# Altium schematic sheet SLT3-PAY-1Q2T_P0.SchDoc: SVPXFMC Carrier 3U
size A4; CheckedBy: \; Author: G.Kasprowicz; CompanyName: ISE; DrawnBy: T.Przywozki; Organization: WUT ISE; Address1: Warsaw University of Technology; Address2: Nowowiejska 15/19 00-665 Warsaw; Revision: 1.0.; SheetNumber: 14; SheetTotal: 20; Project: SVPXFMC Carrier 3U; ModifiedBy: -; CheckedDate: -; Title2: SpaceVPX P0, SLT3-PAY-1Q2T; DivGrp: ISE; Designer: G. Kasprowicz
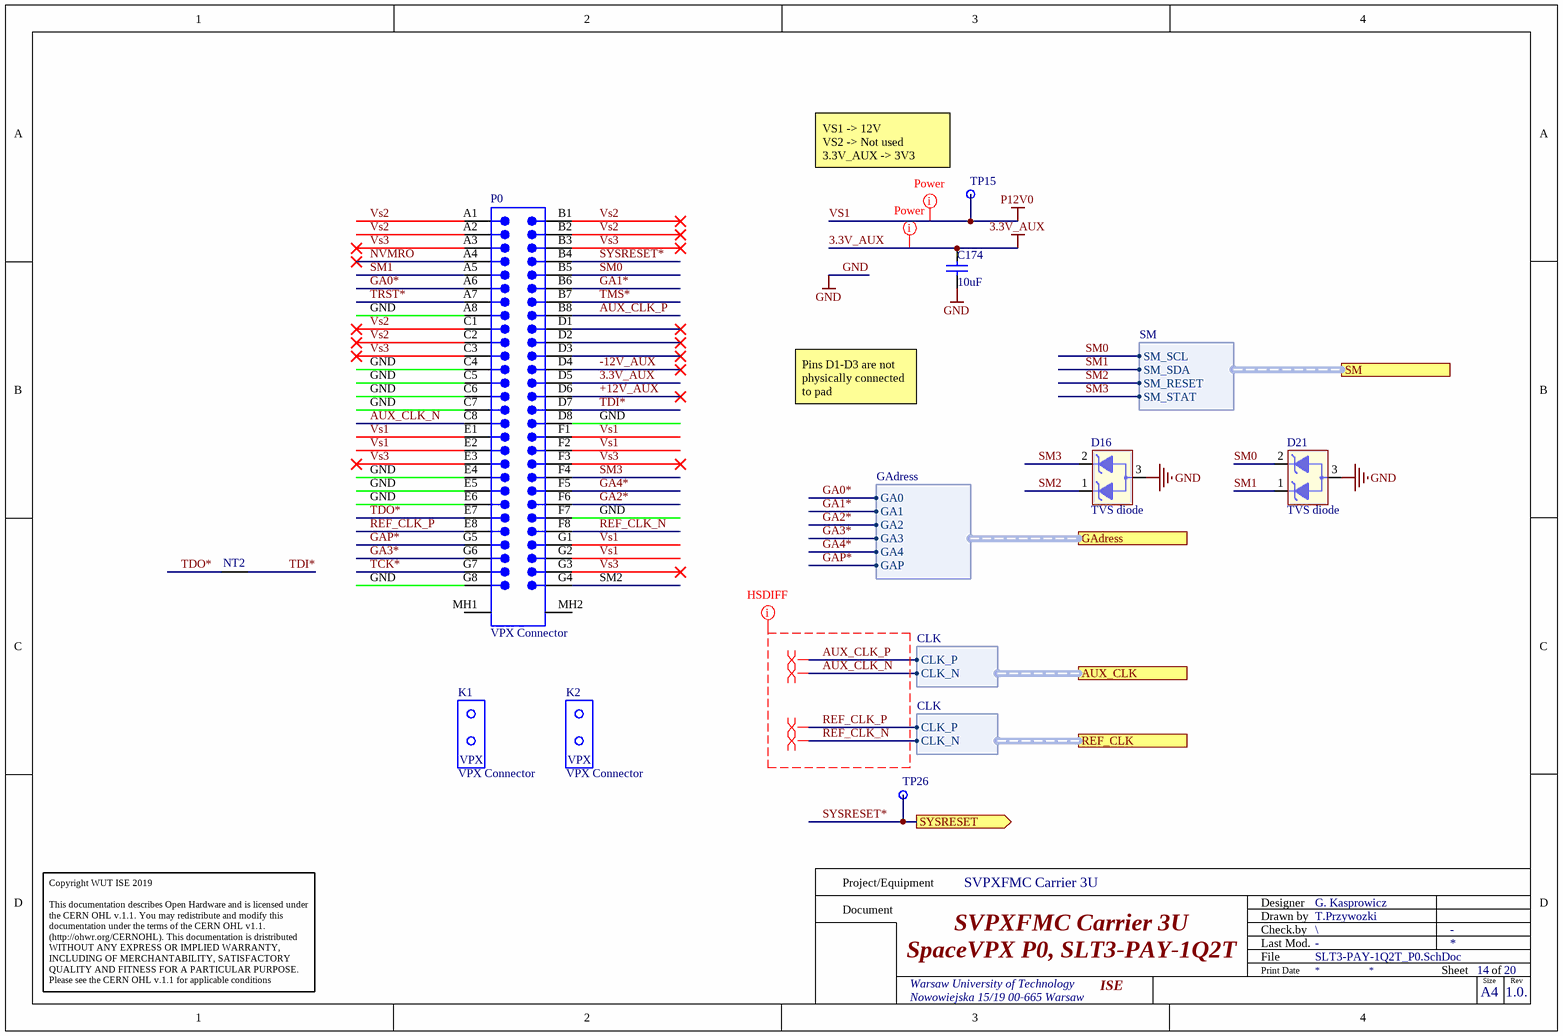
[diagram p0: SLT3-PAY-1Q2T_P0.SchDoc]

## Parts
C174  10uF  [CAPC2012X135N]
D16  TVS diode  [SOT-723_(ESD7C3.3DT5G)]
D21  TVS diode  [SOT-723_(ESD7C3.3DT5G)]
K1  VPX Connector  [BTB5-5-2H2F]
K2  VPX Connector  [BTB5-5-2H2F]
NT2  Net Tie  [Net Tie]  (value not drawn)  (net tie, no BOM)
P0  VPX Connector  [BTB1-8-2H56M]
TP15  Test Point  [TPS127]  (value not drawn)
TP26  Test Point  [TPS127]  (value not drawn)

## Ports
AUX_CLK (harness CLK), GAdress (harness GAdress), REF_CLK (harness CLK), SM (harness SM), SYSRESET (out)

## Harnesses
SM: SM_SCL, SM_SDA, SM_RESET, SM_STAT
GAdress: GA0, GA1, GA2, GA3, GA4, GAP
CLK: CLK_P, CLK_N

## Nets
3.3V_AUX: C174.2 P0.D5
GND: C174.1 D16.3 D21.3 P0.A8 P0.C4 P0.C5 P0.C6 P0.C7 P0.D8 P0.E4 P0.E5 P0.E6 P0.F7 P0.G8
VS1: P0.E1 P0.E2 P0.F1 P0.F2 P0.G1 P0.G2 TP15.1  [also labelled P12V0]
+12V_AUX: P0.D6
-12V_AUX: P0.D4
AUX_CLK_N: P0.C8 ; port AUX_CLK.CLK_N
AUX_CLK_P: P0.B8 ; port AUX_CLK.CLK_P
GA0*: P0.A6 ; port GAdress.GA0
GA1*: P0.B6 ; port GAdress.GA1
GA2*: P0.F6 ; port GAdress.GA2
GA3*: P0.G6 ; port GAdress.GA3
GA4*: P0.F5 ; port GAdress.GA4
GAP*: P0.G5 ; port GAdress.GAP
NVMRO: P0.A4
REF_CLK_N: P0.F8 ; port REF_CLK.CLK_N
REF_CLK_P: P0.E8 ; port REF_CLK.CLK_P
SM0: D21.2 P0.B5 ; port SM.SM_SCL
SM1: D21.1 P0.A5 ; port SM.SM_SDA
SM2: D16.1 P0.G4 ; port SM.SM_RESET
SM3: D16.2 P0.F4 ; port SM.SM_STAT
SYSRESET*: P0.B4 TP26.1 ; port SYSRESET
TCK*: P0.G7
TDI*: NT2.2 P0.D7
TDO*: NT2.1 P0.E7
TMS*: P0.B7
TRST*: P0.A7
Vs2: P0.A1 P0.A2 P0.B1 P0.B2 P0.C1 P0.C2
Vs3: P0.A3 P0.B3 P0.C3 P0.E3 P0.F3 P0.G3

Not connected (* = marked no-connect by the designer): P0 D1* D2* D3* MH1 MH2

## Layout directives
differential pair: AUX_CLK_N, AUX_CLK_P, REF_CLK_N, REF_CLK_P
net class HSDIFF: AUX_CLK_N, AUX_CLK_P, REF_CLK_N, REF_CLK_P
net class Power: 3.3V_AUX, VS1

## Notes on the sheet
- (near TP15) VS1 -> 12V
  VS2 -> Not used
  3.3V_AUX -> 3V3
- Pins D1-D3 are not physically connected to pad
- Project/Equipment
- Document
- Designer
- Drawn by
- Check.by
- Copyright WUT ISE 2019
  This documentation describes Open Hardware and is licensed under the CERN OHL v.1.1. You may redistribute and modify this documentation under the terms of the CERN OHL v1.1.
  (http://ohwr.org/CERNOHL). This documentation is dristributed WITHOUT ANY EXPRESS OR IMPLIED WARRANTY, INCLUDING OF MERCHANTABILITY, SATISFACTORY QUALITY AND FITNESS FOR A PARTICULAR PURPOSE. Please see the CERN OHL v.1.1 for applicable conditions
- File
- Last Mod.
- Print Date
- Sheet
- Size
- A4
- of
- Rev
- (in symbol 2000713-6) VPX

## Library data of the parts
C174 = CC0805_10UF_16V_10%_X5R: Non-polarised capacitor; Part Description: SMD Multilayer Chip Ceramic Capacitor; Manufacturer: GENERIC; Manufacturer1 Part Number: C0805C106K4PAC; Voltage: 16V; TC: X5R; Tolerance: ±10%; Part Number: CC0805_10UF_16V_10%_X5R; Component Kind: Standard; Component Type: Standard; Pin Count: 2; Value: 10uF; Status: Preferred; Manufacturer Part Number: CC0805_10UF_16V_10%_X5R; Case: 0805; Mounted: Yes; Socket: No; SMD: Yes; Sense: No; Manufacturer1 Example: KEMET; Manufacturer1 ComponentHeight: 1.4mm; HelpURL: \\cern.ch\dfs\Applications\Altium\Datasheets\CC1206_X5R_KEMET.pdf; Author: CERN DEM JLC; CreateDate: 03/12/2007; LatestRevisionDate: 03/12/2007
D16 D21 = ESD7C3.3DT5G: Dual TVS diode, Vrwm=3.3V; Manufacturer: ON Semiconductor; Bonding: No; ComponentHeigth: 0.5mm; PressFit: No; Value: 3.3V; Case: SOT-723; Component Kind: Standard; Component Type: Standard; CreateDate: 2018-06-18; Device: TVS diode; HelpURL: https://www.onsemi.com/pub/Collateral/ESD7C3.3D-D.PDF; LatestRevisionDate: 2018-06-18; Manufacturer Part Number: ESD7C3.3DT5G; Mounted: Yes; PackageDescription: SOT-723; Part Description: TVS diode; Part Number: ESD7C3.3DT5G; Pin Count: 3; Sense: No; SMD: Yes; Socket: No
K1 K2 = 2000713-6: VPX VITA 46 Alignment key Ruggedized, Right Angle, 1Key, Key orientation 0; Manufacturer: TE; Bonding: No; ComponentHeigth: 9.7mm; PressFit: No; Case: *; Component Kind: Standard; Component Type: Standard; CreateDate: 2018-01-01; Device: 2000713-6; Footprint: 2000713-6; HelpURL: *; LatestRevisionDate: 2018-01-01; Manufacturer Part Number: 2000713-6; Mounted: Yes; PackageDescription: *; Part Description: VPX VITA 46 Alignment key Ruggedized, Right Angle, 1Key, Key orientation 0; Part Number: 2000713-6; Pin Count: *; Sense: No; SMD: Yes; Socket: No; Family: VPX Connector
NT2 = Net Tie: Part Description: Net Tie (2 Nets); Mounted: No; Part Number: Net Tie; Component Type: Net Tie; Pin Count: 2; Family: Net Tie; Socket: No; SMD: No; Sense: No; Status: None; ComponentHeight: 0mm; HelpURL: Undefined; Author: CERN DEM JLC; CreateDate: 22.03.2011; LatestRevisionDate: 22.03.2011; PackageDescription: 2 Plated Through Hole For Coaxial Cable Link: Hole Dia.=1.4mm Pad Dia.=2.5mm
P0 = 2102772-1: Ruggedized Board-to-Board Connector, Right Angle, 7-Row, Pitch 1.8mm, 56-Position; Manufacturer: TE; Bonding: No; ComponentHeigth: 14.7mm; PressFit: No; Case: *; Component Kind: Standard; Component Type: Standard; CreateDate: 2018-01-01; Device: 2102772-1; Footprint: 2102772-1; HelpURL: *; LatestRevisionDate: 2018-01-01; Manufacturer Part Number: 2102772-1; Mounted: Yes; PackageDescription: *; Part Description: Ruggedized Board-to-Board Connector, Right Angle, 7-Row, Pitch 1.8mm, 56-Position; Part Number: 2102772-1; Pin Count: *; Sense: No; SMD: Yes; Socket: No; Family: VPX Connector
TP15 TP26 = SMD_PAD_1.27X1.27MM: Part Description: 1.27mm x 1.27mm PCB Copper Area (SMD Test Point); Mounted: No; Part Number: SMD_PAD_1.27X1.27MM; Component Kind: Standard (No BOM); Component Type: Standard (No BOM); Pin Count: 1; Family: Test Point; Socket: No; SMD: Yes; Sense: No; Status: None; ComponentHeight: 0mm; HelpURL: Undefined; Author: CERN DEM JLC; CreateDate: 12.01.2008; LatestRevisionDate: 12.01.2008; PackageDescription: 1.27mm x 1.27mm PCB Copper Area (SMD Test Point)